# Altium project test.PrjPcb
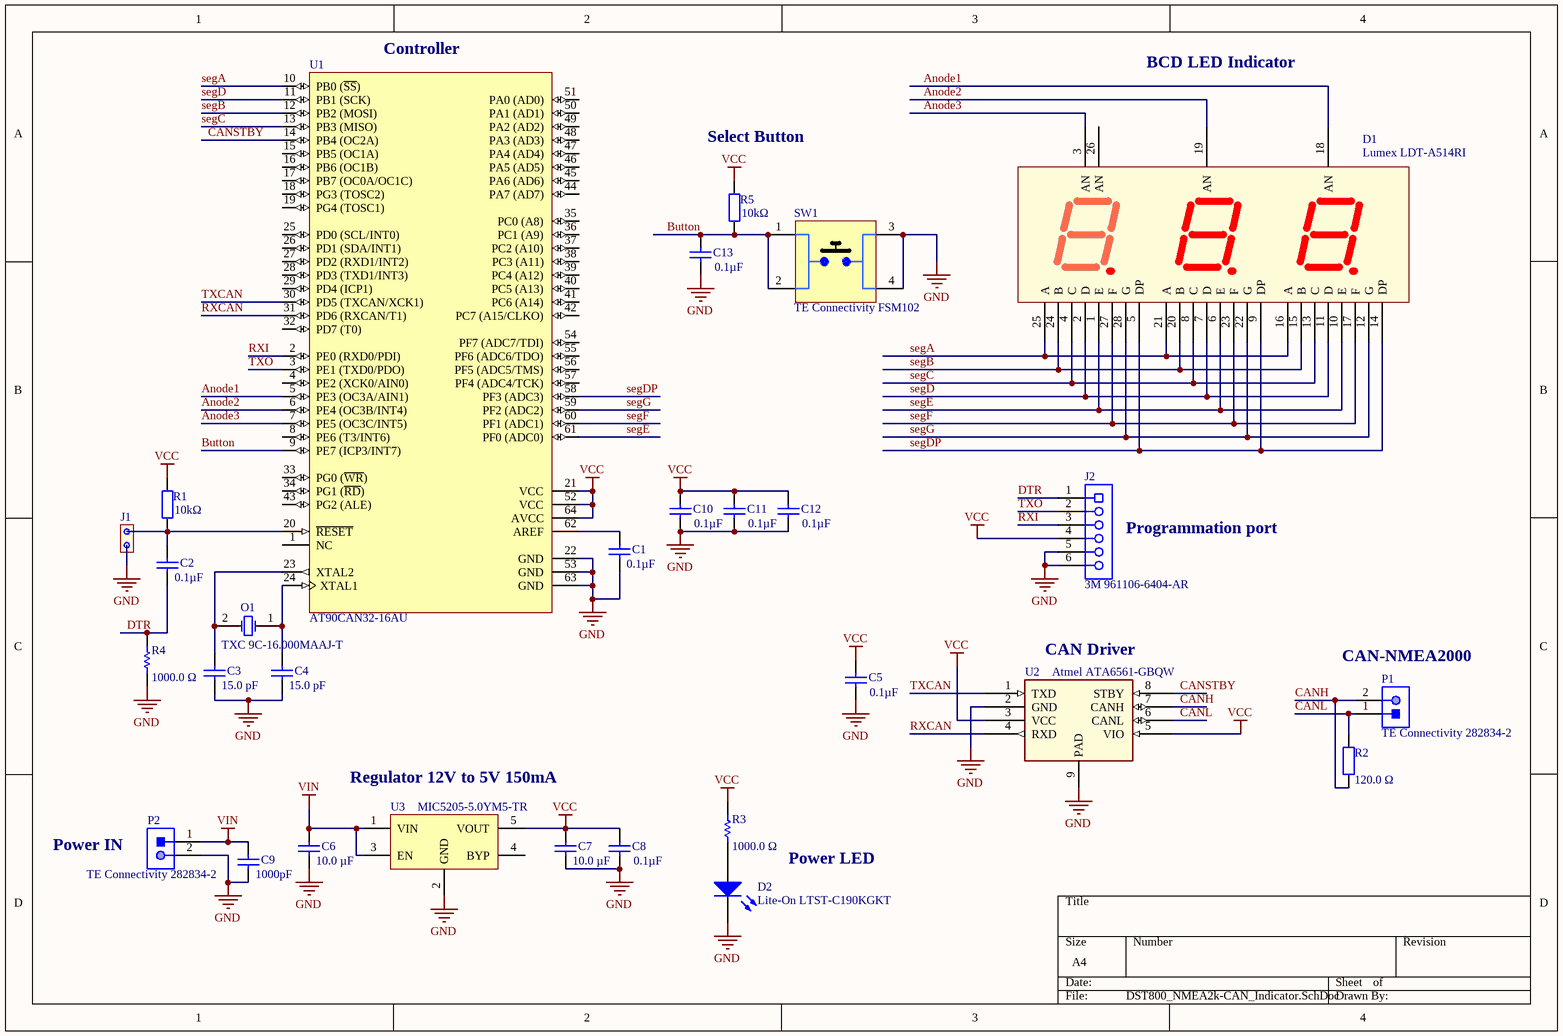
[diagram p0: DST800_NMEA2k-CAN_Indicator.SchDoc]
1 sheet, 29 parts. Net scope: global (net labels, ports and power ports of the same name join across sheets).

## Sheet DST800_NMEA2k-CAN_Indicator.SchDoc
size A4

### Parts
C1  Capacitance: 0.1µF  [PCB-mhhqftc5ilnrg4qi8ds6-1]  (hidden comment: Cap)
C2  Capacitance: 0.1µF  [PCB-mhhqftc5ilnrg4qi8ds6-1]  (hidden comment: Cap)
C3  Capacitance: 15.0 pF  [PCB-69ec8bfnjhyebnpbrrfx-1]  (hidden comment: Cap)
C4  Capacitance: 15.0 pF  [PCB-69ec8bfnjhyebnpbrrfx-1]  (hidden comment: Cap)
C5  Capacitance: 0.1µF  [PCB-mhhqftc5ilnrg4qi8ds6-1]  (hidden comment: Cap)
C6  Capacitance: 10.0 µF  [PCB-j0jk5xr8qbnaskonccg4-1]  (hidden comment: Cap)
C7  Capacitance: 10.0 µF  [PCB-j0jk5xr8qbnaskonccg4-1]  (hidden comment: Cap)
C8  Capacitance: 0.1µF  [PCB-mhhqftc5ilnrg4qi8ds6-1]  (hidden comment: Cap)
C9  Capacitance: 1000pF  [CAPC1608X90X35LL15T15]  (hidden comment: AVX Interconnect / Elco 06031C102MAT2A)
C10  Capacitance: 0.1µF  [PCB-mhhqftc5ilnrg4qi8ds6-1]  (hidden comment: Cap)
C11  Capacitance: 0.1µF  [PCB-mhhqftc5ilnrg4qi8ds6-1]  (hidden comment: Cap)
C12  Capacitance: 0.1µF  [PCB-mhhqftc5ilnrg4qi8ds6-1]  (hidden comment: Cap)
C13  Capacitance: 0.1µF  [PCB-mhhqftc5ilnrg4qi8ds6-1]  (hidden comment: Cap)
D1  Lumex LDT-A514RI  [LDTA514RI]
D2  Lite-On LTST-C190KGKT  [PCB-eapfwhp0rnksgujf96h3-1]
J1  TE Connectivity 5-146281-2  [PCB-angfy19quc8nc8nc7d0m-1]  (value not drawn)
J2  3M 961106-6404-AR  [PCB-660833-1]
O1  TXC 9C-16.000MAAJ-T  [PCB-3qvzojcyidn2gltqqmbl-1]
P1  TE Connectivity 282834-2  [PCB-0kdx5sneyudsmu18l6zv-1]
P2  TE Connectivity 282834-2  [PCB-0kdx5sneyudsmu18l6zv-1]
R1  Resistance: 10kΩ  [RESC1608X55X30NL15T15]  (hidden comment: Res2)
R2  Resistance: 120.0 Ω  [RESC3216X60X45LL10T20]  (hidden comment: Vishay Dale CRCW1206120RJNEA)
R3  Resistance: 1000.0 Ω  [RESC1608X55X30NL20T20]  (hidden comment: Panasonic ERA-3YEB102V)
R4  Resistance: 1000.0 Ω  [RESC1608X55X30NL20T20]  (hidden comment: Panasonic ERA-3YEB102V)  (no BOM)
R5  Resistance: 10kΩ  [RESC1608X55X30NL15T15]  (hidden comment: Res2)
SW1  TE Connectivity FSM102  [PCB-8ps4wla3pj92cxv2yuvu-1]
U1  AT90CAN32-16AU  [64A_L]
U2  Atmel ATA6561-GBQW  [PCBComponent_1]
U3  MIC5205-5.0YM5-TR  [SOT-23-5_N]

### Nets
GND: C1.1 C3.1 C4.1 C5.1 C6.1 C7.1 C8.1 C9.1 C10.1 C11.1 C12.1 C13.1 D2.2(K) J1.2 J2.5 J2.6 P2.2 R4.1 SW1.3 SW1.4 U1.22(GND) U1.53(GND) U1.63(GND) U2.2(GND) U2.9(PAD) U3.2(GND)
VCC: C5.2 C7.2 C8.2 C10.2 C11.2 C12.2 J2.4 R1.2 R3.2 R5.2 U1.21(VCC) U1.52(VCC) U1.64(AVCC) U2.3(VCC) U2.5(VIO) U3.5(VOUT)
VIN: C6.2 C9.2 P2.1 U3.1(VIN) U3.3(EN)
Anode1: D1.18(AN) U1.5(PE3_(OC3A/AIN1))
Anode2: D1.19(AN) U1.6(PE4_(OC3B/INT4))
Anode3: D1.3(AN) U1.7(PE5_(OC3C/INT5))
Button: C13.2 R5.1 SW1.1 SW1.2 U1.9(PE7_(ICP3/INT7))
CANH: P1.2 R2.1 U2.7(CANH)
CANL: P1.1 R2.2 U2.6(CANL)
CANSTBY: U1.14(PB4_(OC2A)) U2.8(STBY)
DTR: C2.1 J2.1 R4.2
RXCAN: U1.31(PD6_(RXCAN/T1)) U2.4(RXD)
RXI: J2.3 U1.2(PE0_(RXD0/PDI))
segA: D1.16(A) D1.21(A) D1.25(A) U1.10(PB0_(~{SS}))
segB: D1.15(B) D1.20(B) D1.24(B) U1.12(PB2_(MOSI))
segC: D1.4(C) D1.8(C) D1.13(C) U1.13(PB3_(MISO))
segD: D1.2(D) D1.7(D) D1.11(D) U1.11(PB1_(SCK))
segDP: D1.5(DP) D1.9(DP) D1.14(DP) U1.58(PF3_(ADC3))
segE: D1.1(E) D1.6(E) D1.10(E) U1.61(PF0_(ADC0))
segF: D1.17(F) D1.23(F) D1.27(F) U1.60(PF1_(ADC1))
segG: D1.12(G) D1.22(G) D1.28(G) U1.59(PF2_(ADC2))
TXCAN: U1.30(PD5_(TXCAN/XCK1)) U2.1(TXD)
TXO: J2.2 U1.3(PE1_(TXD0/PDO))
NetC1_2: C1.2 U1.62(AREF)
NetC2_2: C2.2 J1.1 R1.1 U1.20(~{RESET})
NetC3_2: C3.2 O1.2(X2) U1.23(XTAL2)
NetC4_2: C4.2 O1.1(X1) U1.24(XTAL1)
NetD2_1: D2.1(A) R3.1

Not connected (* = marked no-connect by the designer): D1 26(AN); U1 1(NC) 4(PE2_(XCK0/AIN0)) 8(PE6_(T3/INT6)) 15(PB5_(OC1A)) 16(PB6_(OC1B)) 17(PB7_(OC0A/OC1C)) 18(PG3_(TOSC2)) 19(PG4_(TOSC1)) 25(PD0_(SCL/INT0)) 26(PD1_(SDA/INT1)) 27(PD2_(RXD1/INT2)) 28(PD3_(TXD1/INT3)) 29(PD4_(ICP1)) 32(PD7_(T0)) 33(PG0_(~{WR})) 34(PG1_(~{RD})) 35(PC0_(A8)) 36(PC1_(A9)) 37(PC2_(A10)) 38(PC3_(A11)) 39(PC4_(A12)) 40(PC5_(A13)) 41(PC6_(A14)) 42(PC7_(A15/CLKO)) 43(PG2_(ALE)) 44(PA7_(AD7)) 45(PA6_(AD6)) 46(PA5_(AD5)) 47(PA4_(AD4)) 48(PA3_(AD3)) 49(PA2_(AD2)) 50(PA1_(AD1)) 51(PA0_(AD0)) 54(PF7_(ADC7/TDI)) 55(PF6_(ADC6/TDO)) 56(PF5_(ADC5/TMS)) 57(PF4_(ADC4/TCK)); U3 4(BYP)

### Notes on the sheet
- (near U1) Controller
- BCD LED Indicator
- (near R5) Select Button
- (near J2) Programmation port
- (near U2) CAN Driver
- (near P1) CAN-NMEA2000
- Regulator 12V to 5V 150mA
- (near P2) Power IN
- Power LED

### Library data of the parts
C1 C2 C5 C8 C10-C13 = CMP-1af8d38ac64bc53f-5: CAP CER 0.1UF 50V X7R 0603; Manufacturer: Samsung Electro-Mechanics; Vendor Part Number: 1276-1000-1-ND; Manufacturer Part Number: CL10B104KB8NNNC; Vendor: Digikey; Tolerance: ±10%; Package / Case: 0603 (1608 Metric); Octopart URL: https://octopart.com/cl10b104kb8nnnc-samsung-7928277; Operating Temperature: -55°C ~ 125°C; Thickness (Max): 0.035" (0.90mm); HelpURL: https://media.digikey.com/pdf/Data%20Sheets/Samsung%20PDFs/CL_Series_MLCC_ds.pdf; Size / Dimension: 0.063" L x 0.031" W (1.60mm x 0.80mm); Temperature Coefficient: X7R; OctopartID: 1af8d38ac64bc53f; Applications: General Purpose; Mounting Type: Surface Mount, MLCC; Voltage - Rated: 50V
C3 C4 = CMP-57259fa49f8088e2-2: Multilayer Ceramic Capacitor, C Series, 15 pF, - 5%, C0G / NP0, 50 V, 0603 [1608 Metric]; Size-Thickness: 800 µm; Dielectric Characteristic: C0G/NP0; Octopart URL: https://octopart.com/c1608c0g1h150j080aa-tdk-25947587; OctopartID: 57259fa49f8088e2
C6 C7 = CMP-2bdce35de069f41b-1: C Series 1210 10 uF 25 V ±10 % Tolerance X7R SMT Multilayer Ceramic Capacitor; Lead-Free Status: Lead Free; Voltage Rating (DC): 25.0 V; Dielectric Material: Ceramic Multilayer; Size-Length: 3.20 mm; Case/Package: 1210; OctopartID: 2bdce35de069f41b; Size-Width: 2.50 mm; REACH SVHC Compliance: No SVHC; Size-Thickness: 2.50 mm; RoHS: Compliant; Octopart URL: http://octopart.com/c3225x7r1e106k250ac-tdk-25947859; Mounting Style: Surface Mount
C9 = CMP-126202-2: CAP CER 1000PF 100V 20% X7R 0603; Lead-Free Status: Lead Free; Voltage Rating (DC): 100.0 V; Manufacturer Part Number: 06031C102MAT2A; Capacitance Tolerance: ±20%; Case/Package: 0603; Dielectric Characteristic: X7R; Mounting Style: Surface Mount; Number of Pins: 2; Octopart Url: https://octopart.com/06031c102mat2a-avx+interconnect+%2F+elco-195738; OctopartID: 2b04e20cf2f8f4c3; Packaging: Cut Tape (CT); RoHS: Compliant; Size-Height: 0.00086 m; Size-Length: 0.0016 m; Size-Width: 0.00081 m
D1 = CMP-6dbba4b18441b27c-1: Display, 7-Segment; 3900 mucd (Typ.) @ 10 mA; 635 nm (Typ.); 0.56 in.; -40 degC; Character Size-Height: 14.2 mm; Pin Pitch: 2.54 mm; Lead-Free Status: Lead Free; Peak Wavelength: 635 nm; Luminous Intensity: 3.90 mcd; Forward Voltage: 2.00 V; Color: Red, Orange; Octopart URL: http://octopart.com/ldt-a514ri-lumex-52380; Manufacturer Part Number: LDT-A514RI; Size-Height: 19.1 mm; Case/Package: DIP; Size-Width: 19.1 mm; RoHS: Compliant; Mounting Style: Through Hole; Size-Length: 37.6 mm; Wavelength: 635 nm; Number of Pins: 28; OctopartID: 6dbba4b18441b27c
D2 = CMP-e1642866a00b3ea3-3: LED; SMD; 0603; green; 18-71mcd; 1.6x0.8x0.8mm; 130°; 1.9÷2.4V; 20mA; Lens Type: Non-Diffused; Lead-Free Status: Lead Free; Forward Voltage: 2.00 V; Wavelength: 574 nm; Luminous Intensity: 35.0 mcd; Size-Length: 1.60 mm; Manufacturer Part Number: LTST-C190KGKT; Octopart URL: http://octopart.com/ltst-c190kgkt-lite-on-549897; OctopartID: e1642866a00b3ea3; Color: Green; Viewing Angle: 130 °; Case/Package: 0603; Size-Height: 800 µm; RoHS: Compliant; Size-Width: 800 µm; Packaging: Cut Tape (CT), Tape & Reel (TR); Mounting Style: Surface Mount, Vertical
J1 = CMP-39c9f206a0b6e60e-14: Header; Breakaway; 0.100 in.; PC Board; Single; 2; 0.025 in.; 0.12 in.; 3 A; Number of Contacts: 2; Gender: Male; ELV Compliant: Compliant; Manufacturer Part Number: 5-146281-2; Contact Plating: Gold, Tin Lead; OctopartID: 39c9f206a0b6e60e; Flammability Rating: UL 94 V-0; Contact Material: Copper Alloy
J2 = CMP-660833-2: CONN HEADER VERT SGL 6POS GOLD; Gender: Male; Number of Contacts: 6; Contact Material: Copper Alloy; Contact Plating: Gold; Mounting Style: Through Hole; Octopart Url: https://octopart.com/961106-6404-ar-3m-14400736; OctopartID: f2bb3b6a6b3d2d7c; RoHS: Compliant; Manufacturer Part Number: 961106-6404-AR
O1 = CMP-df271731c43900e0-3: Crystal 16MHz ?30ppm (Tol) ?30ppm (Stability) 18pF FUND 30Ohm 2-Pin HC-49/S SMD T/R; Frequency: 16.0 MHz; Load Capacitance: 18.0 pF; REACH SVHC Compliance: No SVHC; OctopartID: df271731c43900e0; Mounting Style: Surface Mount; Number of Pins: 2; RoHS: Compliant; Manufacturer Part Number: 9C-16.000MAAJ-T; Packaging: Cut Tape (CT); Octopart URL: http://octopart.com/9c-16.000maaj-t-txc-18628216
P1 P2 = CMP-369bfdc835bbe95c-32: Connector, Terminal Block; Wire Receptacle; 2 Pos.; 16-30 AWG; 0.197 in. CL; Sid; Flammability Rating: UL 94 V-0; Mounting Style: PC Board, Screw, PCB; Octopart URL: https://octopart.com/282836-2-te+connectivity-39396934
R1 R5 = CMP-584891b72cc4878f-2: Resistor; Thick Film; Res 10 Kilohms; Pwr-Rtg 0.1 W; Tol 1%; SMT; 0603; Manufacturer Part Number: CRG0603F10K; Power Rating: 0.1 W; ELV Compliant: Compliant; Case/Package: 0603; Octopart URL: http://octopart.com/crg0603f10k-te+connectivity-16077290; OctopartID: 584891b72cc4878f; Packaging: Tape & Reel (TR); Lifecycle Status: Active; Mounting Style: Surface Mount; RoHS: Compliant
R2 = CMP-1858100-4: RES SMD 120 OHM 5% 1/4W 1206; Voltage Rating (DC): 200.0 V; Lead-Free Status: Lead Free; Power Rating: 0.25 W; Temperature Coefficient: 200.0 ppm/°C; Case/Package (SI): 3216; Number of Pins: 2; Resistance Tolerance: ±5%; Octopart Url: https://octopart.com/crcw1206120rjnea-vishay+dale-39437323; Mounting Style: Surface Mount; RoHS: Compliant; Size-Length: 0.0032 m; Case/Package: 1206; OctopartID: 57d69c85b6bb8811; Size-Height: 0.00055 m; Packaging: Cut Tape (CT); Manufacturer Part Number: CRCW1206120RJNEA; Size-Width: 0.0016 m
R3 R4 = CMP-3717598-2: Metal Film Resistors 1K    OHM  .1% 25PPM; Lead-Free Status: Lead Free; Power Rating: 0.063 W; Resistance Tolerance: ±0.1%; Voltage Rating (DC): 75.0 V; Lifecycle Status: Not Listed by Manufacturer; Mounting Style: Surface Mount; Octopart Url: https://octopart.com/era-3yeb102v-panasonic-55477313; OctopartID: 4ba281e6ea859465; Packaging: Cut Tape (CT); RoHS: Compliant; Size-Height: 0.00045 m; Size-Length: 0.0016 m; Size-Width: 0.0008 m; Manufacturer Part Number: ERA-3YEB102V
SW1 = CMP-43e488b0e8c29c23-11: Momentary Tactile SPST Thru-Hole; Lead-Free Status: Lead Free; ELV Compliant: Compliant; Contact Current Rating: 50.0 mA; Contact Resistance: 100 mΩ (max); Mounting Style: Through Hole; Manufacturer Part Number: FSM102; OctopartID: 43e488b0e8c29c23; Contacts Type: SPST; RoHS: Compliant; Contact Material: Copper Alloy; Operating Temperature: 85.0 °C (max); Size-Length: 6.0 mm
U1 = CMP-972593-3: 8-bit AVR Microcontroller, 32KB Flash and CAN Controller, 53 GPIO pins, Industrial Grade (-40° to +85°C), 64-pin LQFP, Green; Access Time: 1.6e-05 s; Clock Speed: 16000000.0 Hz; FLASH Memory Size: 32768 B; Lead-Free Status: Lead Free; Number of Bits: 8; Number of I/O Pins: 53; RAM Memory Size: 2048 B; Supply Voltage (DC): 5.0 V; Case/Package: TQFP; Core Architecture: AVR; Mounting Style: Surface Mount; Number of Pins: 64; Octopart Url: https://octopart.com/at90can32-16au-atmel-39961781; OctopartID: ffbd34d61e6e207a; Packaging: Tray; REACH SVHC Compliance: No SVHC; RoHS: Compliant; Manufacturer Part Number: AT90CAN32-16AU
U2 = CMP-9a565056add04591-7: CAN 5Mbps Normal/Silent/Standby 5V Automotive 8-Pin VDFN EP T/R; Manufacturer Part Number: ATA6561-GBQW; RoHS: Compliant; OctopartID: 9a565056add04591; Octopart URL: http://octopart.com/ata6561-gbqw-atmel-50991840
U3 = CMP-6255a8a416e5bd92-5: Microchip MIC5205 Series 5 V Fixed Output 150 mA SMT Low-Noise LDO Regulator - SOT-23-5; Number of Outputs: 1; Output Voltage: 5.00 V; Octopart URL: https://octopart.com/mic5205-5.0ym5-tr-microchip-66802134; Supplier Part Number 1: 998-MIC5205-5.0YM5TR; RoHS: Compliant